# Altium schematic sheet CP_schem.SchDoc
size A4; SheetNumber: 1; SheetTotal: 1
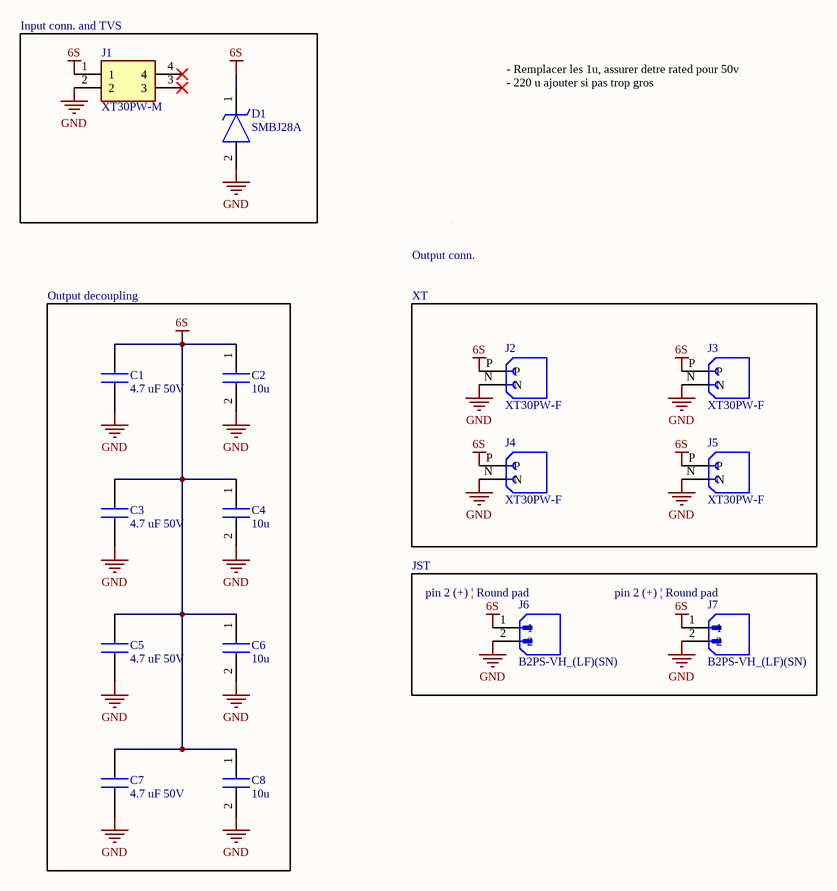
[diagram p0: CP_schem.SchDoc]

## Parts
C1  4.7 uF 50V  [CAPC2012X145N]
C2  10u  [GRM32x]
C3  4.7 uF 50V  [CAPC2012X145N]
C4  10u  [GRM32x]
C5  4.7 uF 50V  [CAPC2012X145N]
C6  10u  [GRM32x]
C7  4.7 uF 50V  [CAPC2012X145N]
C8  10u  [GRM32x]
D1  SMBJ28A  [SMBJ12A]
J1  XT30PW-M  [XT30PWM]
J2  XT30PW-F  [AMASS_XT30PW-F]
J3  XT30PW-F  [AMASS_XT30PW-F]
J4  XT30PW-F  [AMASS_XT30PW-F]
J5  XT30PW-F  [AMASS_XT30PW-F]
J6  B2PS-VH_(LF)(SN)  [JST_B2PS-VH_(LF)(SN)]
J7  B2PS-VH_(LF)(SN)  [JST_B2PS-VH_(LF)(SN)]

## Blocks framed on the sheet
Input conn. and TVS: D1 J1
Output decoupling: C1-C8
XT: J2-J5

## Nets
6S: C1.1 C2.1 C3.1 C4.1 C5.1 C6.1 C7.1 C8.1 D1.1(K) J1.1 J2.P J3.P J4.P J5.P J6.1 J7.1
GND: C1.2 C2.2 C3.2 C4.2 C5.2 C6.2 C7.2 C8.2 D1.2(A) J1.2 J2.N J3.N J4.N J5.N J6.2 J7.2

Not connected (* = marked no-connect by the designer): J1 3* 4*

## Notes on the sheet
- Output conn.
- - Remplacer les 1u, assurer detre rated pour 50v
  - 220 u ajouter si pas trop gros
- JST
- (near J6) pin 2 (+) | Round pad
- (near J7) pin 2 (+) | Round pad

## Library data of the parts
C1 C3 C5 C7 = GRM21BR61H475KE51L: Capacitor; Manufacturer_Name: Murata Electronics; Datasheet Link: https://search.murata.co.jp/Ceramy/image/img/A01X/G101/ENG/GRM21BR61H475KE51-01A.pdf; Height: 1.45mm; Manufacturer_Part_Number: GRM21BR61H475KE51L; Mouser Part Number: 81-GRM21BR61H475KE1L; Mouser Price/Stock: https://www.mouser.co.uk/ProductDetail/Murata-Electronics/GRM21BR61H475KE51L?qs=eeBpzGFlv%252B%252BOtLzDC1PY6Q%3D%3D; Arrow Part Number: GRM21BR61H475KE51L; Arrow Price/Stock: https://www.arrow.com/en/products/grm21br61h475ke51l/murata-manufacturing?region=nac
C2 C4 C6 C8 = GRM32EC72A106ME05L: Capacitor; Manufacturer_Name: Murata Electronics; Datasheet Link: https://search.murata.co.jp/Ceramy/image/img/A01X/G101/ENG/GRM32EC72A106ME05-01A.pdf; Height: 1.5mm; Manufacturer_Part_Number: GRM32EC72A106ME05L; Mouser Part Number: 81-GRM32EC72A106ME5L; Mouser Price/Stock: https://www.mouser.co.uk/ProductDetail/Murata-Electronics/GRM32EC72A106ME05L?qs=d0WKAl%252BL4KZOI4c17DDTDA%3D%3D; Arrow Part Number: GRM32EC72A106ME05L; Arrow Price/Stock: https://www.arrow.com/en/products/grm32ec72a106me05l/murata-manufacturing?region=nac
D1 = SMBJ28A: TVS Diode (Uni-directional); Manufacturer_Name: STMicroelectronics; Datasheet Link: https://www.st.com/resource/en/datasheet/smbj12a.pdf; Height: 2.45mm; Manufacturer_Part_Number: SMBJ28A
J1 = XT30PW-M: Connector; Manufacturer_Name: Amass; Datasheet Link: https://www.tme.eu/sl/Document/ce4077e36b79046da520ca73227e15de/XT30PW%20SPEC.pdf; Height: 5mm; Manufacturer_Part_Number: XT30PW-M
J2-J5 = XT30PW-F: Socket; DC supply; XT30; female; PIN: 2; on PCBs; THT; yellow; 15A; MF: amass; SnapEDA_Link: https://www.snapeda.com/parts/XT30PW-F/AMASS/view-part/?ref=snap; Package: None; Value: *; MP: XT30PW-F; Check_prices: https://www.snapeda.com/parts/XT30PW-F/AMASS/view-part/?ref=eda
J6 J7 = B2PS-VH_(LF)(SN): Connector Header Through Hole, Right Angle 2 position 0.156 (3.96mm); MF: JST; MP: B2PS-VH (LF)(SN); SnapEDA_Link: https://www.snapeda.com/parts/B2PS-VH%20(LF)(SN)/JST/view-part/?ref=snap; Package: None; Value: *; Check_prices: https://www.snapeda.com/parts/B2PS-VH%20(LF)(SN)/JST/view-part/?ref=eda